# Altium schematic sheet Connectors.SchDoc
size A4; Organization: Altium Limited; Address1: 3 Minna Close; Address2: Belrose; Address3: NSW 2085; Address4: Australia
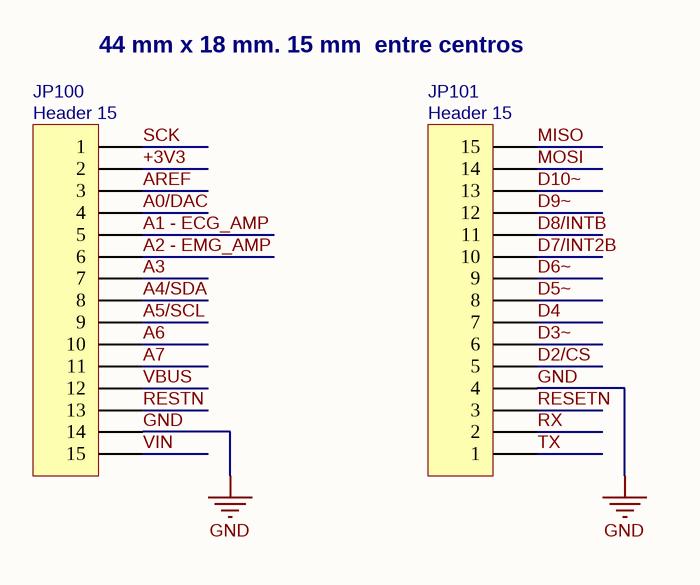
[diagram p0: Connectors.SchDoc]

## Parts
JP100  Header 15  [HDR1X15]
JP101  Header 15  [HDR1X15]

## Nets
GND: JP100.14 JP101.4
+3V3: JP100.2
A0/DAC: JP100.4
A1 - ECG_AMP: JP100.5
A2 - EMG_AMP: JP100.6
A3: JP100.7
A4/SDA: JP100.8
A5/SCL: JP100.9
A6: JP100.10
A7: JP100.11
AREF: JP100.3
D2/CS: JP101.5
D3~: JP101.6
D4: JP101.7
D5~: JP101.8
D6~: JP101.9
D7/INT2B: JP101.10
D8/INTB: JP101.11
D9~: JP101.12
D10~: JP101.13
MISO: JP101.15
MOSI: JP101.14
RESETN: JP101.3
RESTN: JP100.13
RX: JP101.2
SCK: JP100.1
TX: JP101.1
VBUS: JP100.12
VIN: JP100.15

## Notes on the sheet
- 44 mm x 18 mm. 15 mm  entre centros
- Title
- Size:
- Date:
- A4
- Number:
- Time:
- Revision:
- Sheet
- of
- File:

## Library data of the parts
JP100 JP101 = Header 15: Header, 15-Pin; LatestRevisionDate: 17-Jul-2002; LatestRevisionNote: Re-released for DXP Platform.; Publisher: Altium Limited